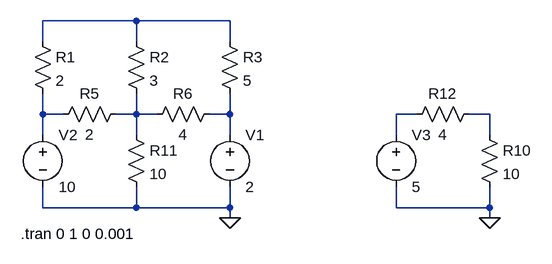
[diagram p0: schematic g2_p9.asc]
g2_p9.asc, the LTspice schematic file:
Version 4
SHEET 1 1028 680
WIRE 208 96 64 96
WIRE 352 96 208 96
WIRE 64 128 64 96
WIRE 208 128 208 96
WIRE 352 128 352 96
WIRE 64 240 64 208
WIRE 96 240 64 240
WIRE 208 240 208 208
WIRE 208 240 176 240
WIRE 240 240 208 240
WIRE 352 240 352 208
WIRE 352 240 320 240
WIRE 640 240 608 240
WIRE 752 240 720 240
WIRE 64 272 64 240
WIRE 208 272 208 240
WIRE 352 272 352 240
WIRE 608 272 608 240
WIRE 752 272 752 240
WIRE 64 384 64 352
WIRE 208 384 208 352
WIRE 208 384 64 384
WIRE 352 384 352 352
WIRE 352 384 208 384
WIRE 608 384 608 352
WIRE 752 384 752 352
WIRE 752 384 608 384
WIRE 352 400 352 384
WIRE 752 400 752 384
FLAG 352 400 0
FLAG 752 400 0
SYMBOL res 48 112 R0
SYMATTR InstName R1
SYMATTR Value 2
SYMBOL res 192 112 R0
SYMATTR InstName R2
SYMATTR Value 3
SYMBOL res 336 112 R0
SYMATTR InstName R3
SYMATTR Value 5
SYMBOL res 192 224 R90
WINDOW 0 0 56 VBottom 2
WINDOW 3 32 56 VTop 2
SYMATTR InstName R5
SYMATTR Value 2
SYMBOL res 336 224 R90
WINDOW 0 0 56 VBottom 2
WINDOW 3 32 56 VTop 2
SYMATTR InstName R6
SYMATTR Value 4
SYMBOL voltage 64 256 R0
WINDOW 123 0 0 Left 0
WINDOW 39 0 0 Left 0
SYMATTR InstName V2
SYMATTR Value 10
SYMBOL res 736 256 R0
SYMATTR InstName R10
SYMATTR Value 10
SYMBOL res 736 224 R90
WINDOW 0 0 56 VBottom 2
WINDOW 3 32 56 VTop 2
SYMATTR InstName R12
SYMATTR Value 4
SYMBOL voltage 608 256 R0
WINDOW 123 0 0 Left 0
WINDOW 39 0 0 Left 0
SYMATTR InstName V3
SYMATTR Value 5
SYMBOL res 192 256 R0
SYMATTR InstName R11
SYMATTR Value 10
SYMBOL voltage 352 256 R0
WINDOW 123 0 0 Left 0
WINDOW 39 0 0 Left 0
SYMATTR InstName V1
SYMATTR Value 2
TEXT 30 424 Left 2 !.tran 0 1 0 0.001

The netlist it stands for:
* g2_p9.asc
R1 N001 N002 2
R2 N001 N003 3
R3 N001 N004 5
R5 N003 N002 2
R6 N004 N003 4
V2 N002 0 10
R10 N006 0 10
R12 N006 N005 4
V3 N005 0 5
R11 N003 0 10
V1 N004 0 2
.tran 0 1 0 0.001
.backanno
.end